# Altium schematic sheet Sheet1-MCU.SchDoc
size A3; SheetNumber: 1; SheetTotal: 2
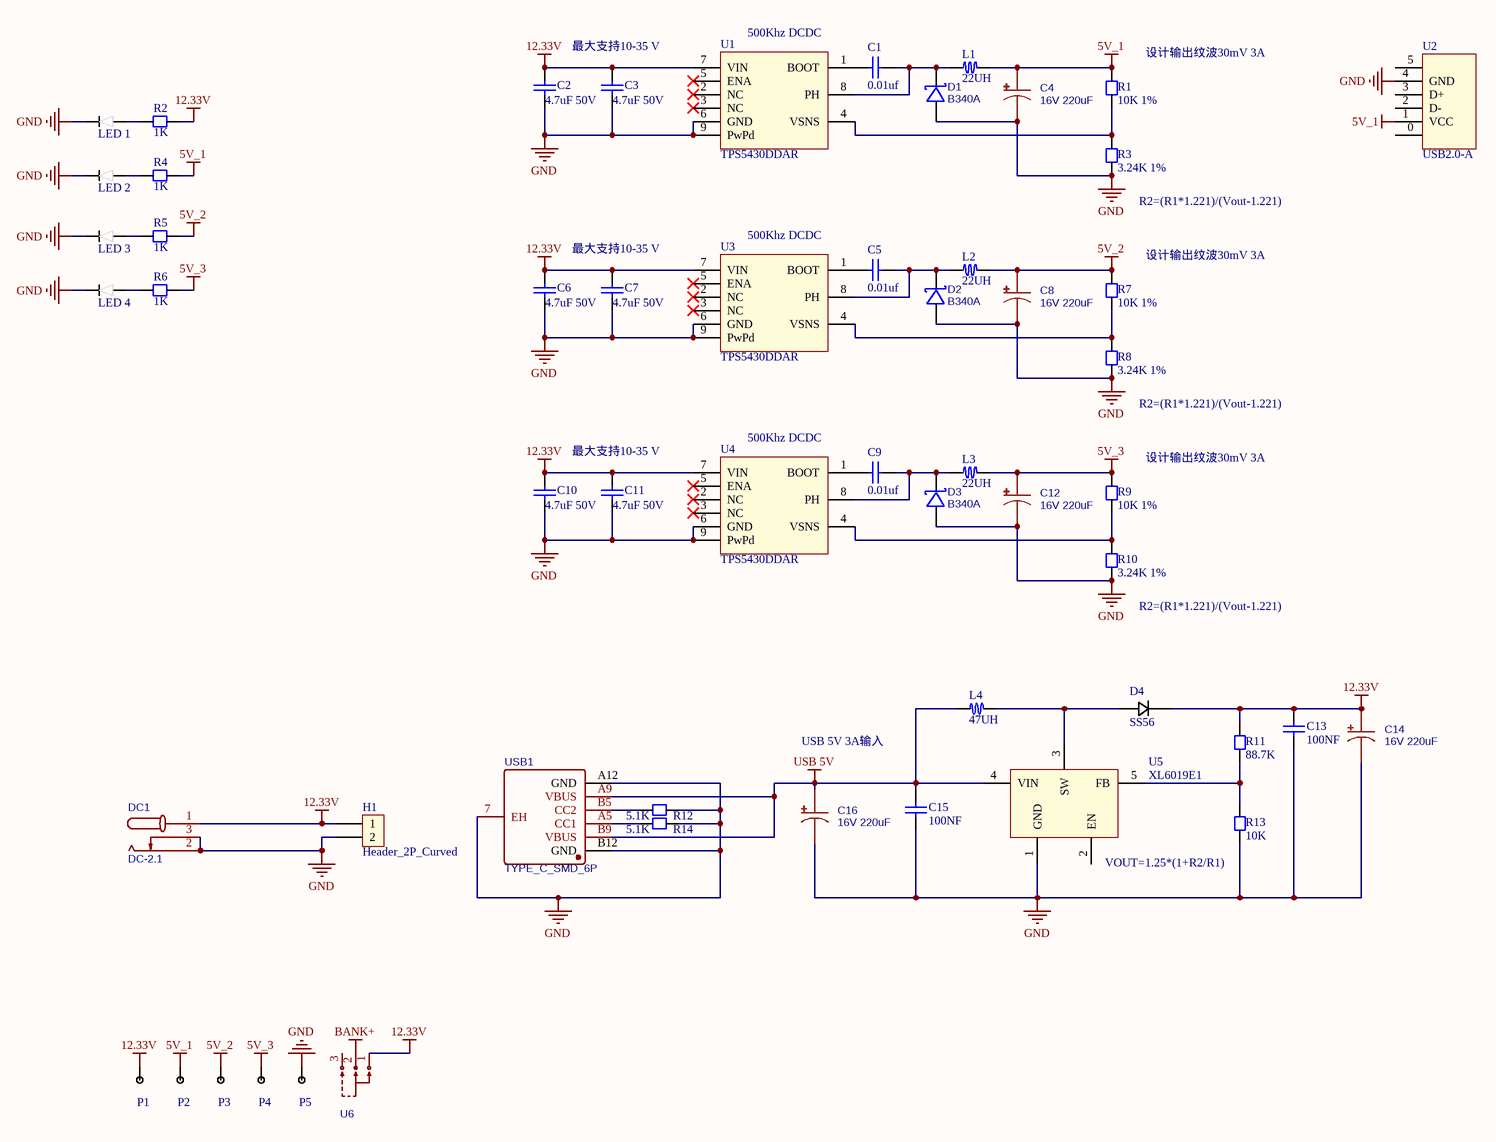
[diagram p0: Sheet1-MCU.SchDoc]

## Parts
C1  0.01uf  [CC1608-0603]
C2  4.7uF 50V  [CC1608-0603]
C3  4.7uF 50V  [CC1608-0603]
C4  16V 220uF  [CAP-SMD_D6.3]
C5  0.01uf  [CC1608-0603]
C6  4.7uF 50V  [CC1608-0603]
C7  4.7uF 50V  [CC1608-0603]
C8  16V 220uF  [CAP-SMD_D6.3]
C9  0.01uf  [CC1608-0603]
C10  4.7uF 50V  [CC1608-0603]
C11  4.7uF 50V  [CC1608-0603]
C12  16V 220uF  [CAP-SMD_D6.3]
C13  100NF  [CC1608-0603]
C14  16V 220uF  [CAP-SMD_D6.3]
C15  100NF  [CC1608-0603]
C16  16V 220uF  [CAP-SMD_D6.3]
D1  B340A  [DO-214 AA]
D2  B340A  [DO-214 AA]
D3  B340A  [DO-214 AA]
D4  SS56  [DO-214 AA]
DC1  DC-2.1  [DC-IN-SMD_DC-050-25A]
H1  Header_2P_Curved  [Header_2_54_2PW]
L1  22UH  [Inductor-1040]
L2  22UH  [Inductor-1040]
L3  22UH  [Inductor-1040]
L4  47UH  [Inductor-1040]
LED_1  LED 0603  [LED 0603]  (value not drawn)
LED_2  LED 0603  [LED 0603]  (value not drawn)
LED_3  LED 0603  [LED 0603]  (value not drawn)
LED_4  LED 0603  [LED 0603]  (value not drawn)
P1  pogopin  [pogopin]  (value not drawn)
P2  pogopin  [pogopin]  (value not drawn)
P3  pogopin  [pogopin]  (value not drawn)
P4  pogopin  [pogopin]  (value not drawn)
P5  pogopin  [pogopin]  (value not drawn)
R1  10K 1%  [CR1608-0603]
R2  1K  [CR1608-0603]
R3  3.24K 1%  [CR1608-0603]
R4  1K  [CR1608-0603]
R5  1K  [CR1608-0603]
R6  1K  [CR1608-0603]
R7  10K 1%  [CR1608-0603]
R8  3.24K 1%  [CR1608-0603]
R9  10K 1%  [CR1608-0603]
R10  3.24K 1%  [CR1608-0603]
R11  88.7K  [CR1608-0603]
R12  5.1K  [CR1608-0603]
R13  10K  [CR1608-0603]
R14  5.1K  [CR1608-0603]
U1  TPS5430DDAR  [SOIC-8-E]
U2  USB2.0-A  [USB2.0-A]
U3  TPS5430DDAR  [SOIC-8-E]
U4  TPS5430DDAR  [SOIC-8-E]
U5  XL6019E1  [TO-263-5]
U6  HX SS12D10G4  [SW-TH_3P-SS12D06]  (value not drawn)
USB1  TYPE_C_SMD_6P  [TYPE-C-SMD_TYPE-C-6P]

## Nets
5V_1: C4.1 L1.2 P2.1 R1.2 R4.1 U2.1(VCC)
5V_2: C8.1 L2.2 P3.1 R5.1 R7.2
5V_3: C12.1 L3.2 P4.1 R6.1 R9.2
12.33V: C2.1 C3.1 C6.1 C7.1 C10.1 C11.1 C13.2 C14.1 D4.1(K) DC1.1 H1.1 P1.1 R2.1 R11.2 U1.7(VIN) U3.7(VIN) U4.7(VIN) U6.1
BANK+: U6.2
GND: C2.2 C3.2 C4.2 C6.2 C7.2 C8.2 C10.2 C11.2 C12.2 C13.1 C14.2 C15.1 C16.2 D1.2(A) D2.2(A) D3.2(A) DC1.2 DC1.3 H1.2 LED_1.2 LED_2.2 LED_3.2 LED_4.2 P5.1 R3.1 R8.1 R10.1 R12.2 R13.1 R14.2 U1.6(GND) U1.9(PwPd) U2.4(GND) U3.6(GND) U3.9(PwPd) U4.6(GND) U4.9(PwPd) U5.1(GND) USB1.7(EH) USB1.A12(GND) USB1.B12(GND)
USB 5V: C15.2 C16.1 L4.1 U5.4(VIN) USB1.A9(VBUS) USB1.B9(VBUS)
NetC1_1: C1.1 U1.1(BOOT)
NetC1_2: C1.2 D1.1(K) L1.1 U1.8(PH)
NetC5_1: C5.1 U3.1(BOOT)
NetC5_2: C5.2 D2.1(K) L2.1 U3.8(PH)
NetC9_1: C9.1 U4.1(BOOT)
NetC9_2: C9.2 D3.1(K) L3.1 U4.8(PH)
NetD4_2: D4.2(A) L4.2 U5.3(SW)
NetLED_1_1: LED_1.1 R2.2
NetLED_2_1: LED_2.1 R4.2
NetLED_3_1: LED_3.1 R5.2
NetLED_4_1: LED_4.1 R6.2
NetR1_1: R1.1 R3.2 U1.4(VSNS)
NetR7_1: R7.1 R8.2 U3.4(VSNS)
NetR9_1: R9.1 R10.2 U4.4(VSNS)
NetR11_1: R11.1 R13.2 U5.5(FB)
NetR12_1: R12.1 USB1.B5(CC2)
NetR14_1: R14.1 USB1.A5(CC1)

Not connected (* = marked no-connect by the designer): U1 2(NC)* 3(NC)* 5(ENA)*; U2 0(5) 2(D-) 3(D+) 5(6); U3 2(NC)* 3(NC)* 5(ENA)*; U4 2(NC)* 3(NC)* 5(ENA)*; U5 2(EN); U6 3

## Notes on the sheet
- 最大支持10-35 V
- (near U1) 500Khz DCDC
- (near R1) 设计输出纹波30mV 3A
- (near R3) R2=(R1*1.221)/(Vout-1.221)
- (near U3) 500Khz DCDC
- (near R7) 设计输出纹波30mV 3A
- (near R8) R2=(R1*1.221)/(Vout-1.221)
- (near U4) 500Khz DCDC
- (near R9) 设计输出纹波30mV 3A
- (near R10) R2=(R1*1.221)/(Vout-1.221)
- USB 5V 3A输入
- VOUT=1.25*(1+R2/R1)

## Library data of the parts
C1-C3 C5-C7 C9-C11 = Chip capacitor: 贴片电容
C4 C8 C12 C14 C16 = Cap ECAP SMD: 铝点解电容; BOM_Manufacturer: PANASONIC; BOM_Manufacturer Part: EEEFP1C681AP; nameAlias: Capacitance; Contributor: LCSC; BOM_Supplier: LCSC; BOM_Supplier Part: C413527; spicePre: C; spiceSymbolName: EEEFP1C681AP
C13 C15 = Cap Chip 0603: 0603封装的电容; Published: 8-Jun-2000; Revision: July-2002: Re-released for DXP Platform.; Publisher: Altium Limited
D1-D3 = B340A: 40V 3A 550mV@3A; BOM_Manufacturer: MDD; BOM_Supplier: LCSC; BOM_Manufacturer Part: B340A; BOM_Supplier Part: C64982; BOM_JLCPCB Part Class: Extended Part; spicePre: D; spiceSymbolName: B340A
D4 = SS34: 肖特基二极管
DC1 = DC-050: DC贴片插座; BOM_Manufacturer: 韩国韩荣; BOM_Manufacturer Part: DC-050-25A; Contributor: LCSC; BOM_Supplier: LCSC; BOM_Supplier Part: C707275; BOM_JLCPCB Part Class: Extended Part; spicePre: D; spiceSymbolName: DC-050-25A
H1 = Header_2P_Curved: 弯的2P排针
L1-L4 = Inductor-1040: 1040封装 一体成型 贴片 功率电感
P1-P5 = pogopin: 插板式顶针 连接器弹簧天线插针SMT触点测试铜针双弹贴片式
R1 R3 R7-R10 = Chip resistor: 贴片电阻
R2 R4-R6 R11-R14 = Resistor Chip 0603: 0603封装电阻; Published: 8-Jun-2000; Revision: July-2002: Re-released for DXP Platform.; Publisher: Altium Limited
U1 U3 U4 = TPS5430DDAR: 宽电压DCDC降压IC
U2 = USB2.0-A: USB母座
U5 = XL6019E1: 升压芯片 5A最大输出
U6 = SW-TH_3P-SS12D06: BOM_Manufacturer: hanxia(韩下); Contributor: lcsc; BOM_Supplier: LCSC; BOM_Supplier Part: C5149841; BOM_Manufacturer Part: HX SS12D10G4; link: https://atta.szlcsc.com/upload/public/pdf/source/20220907/2020D7183ED16DD6E2B9F5A13FB144CF.pdf; BOM_JLCPCB Part Class: Extended Part; spicePre: U; spiceSymbolName: HX SS12D10G4
USB1 = TYPE_C_SMD_6P: Manufacturer: null; Contributor: LCSC; Supplier: LCSC; Supplier Part: C9900003080; Manufacturer Part: TYPE_C_SMD_6P; JLCPCB Part Class: Extended Part; spicePre: U; spiceSymbolName: TYPE_C_SMD_6P